# EAGLE design dip40_a1 (EAGLE 5.11)
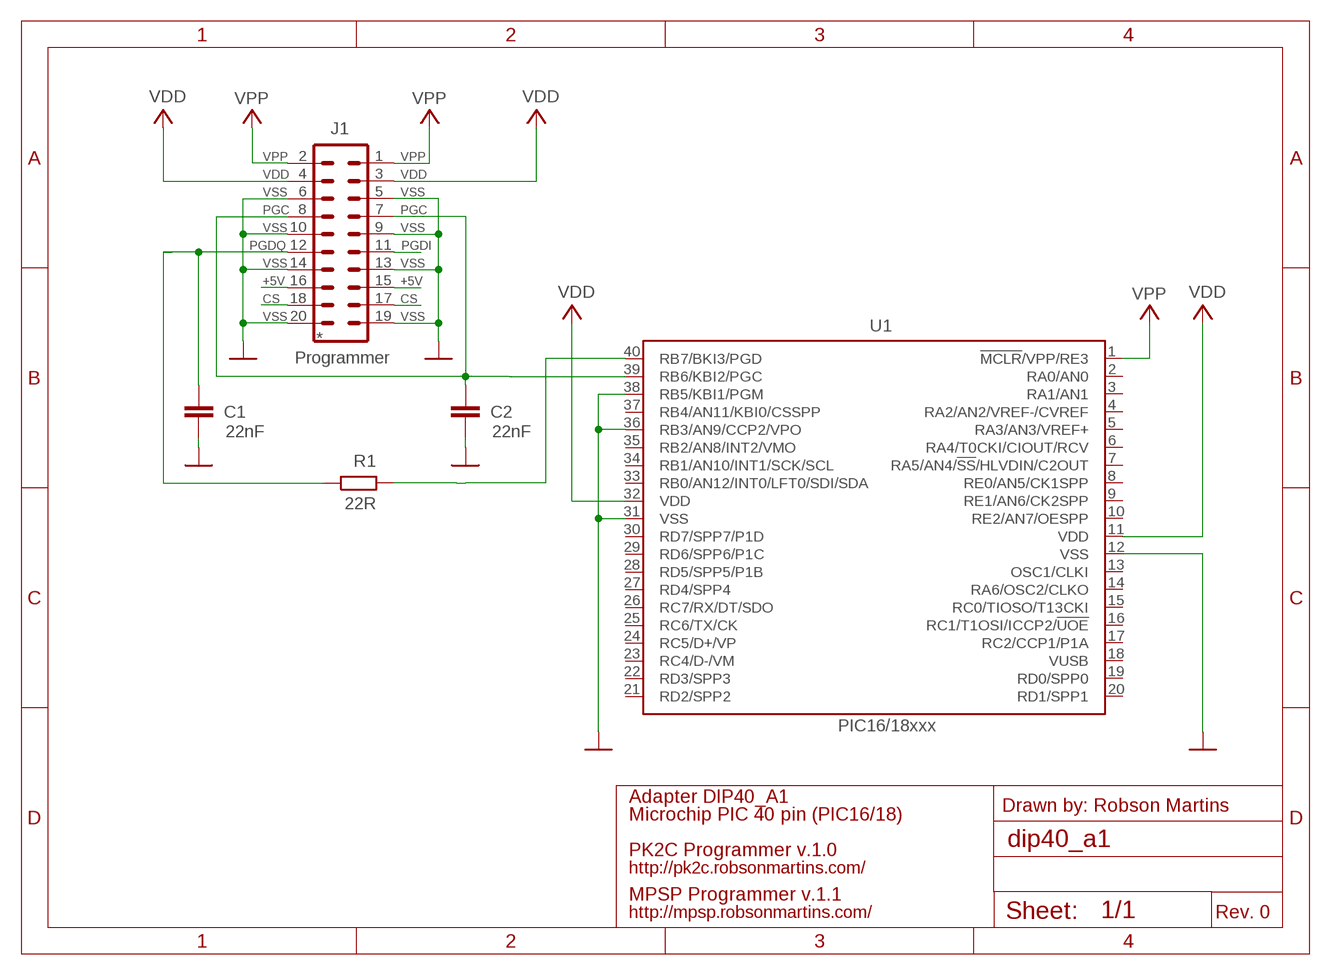
[diagram p0: schematic, sheet 1]

## Parts
C1  22nF  C-EU025-025X050  [C025-025X050]
C2  22nF  C-EU025-025X050  [C025-025X050]
J1  Programmer  MA10-2  [MA10-2]
R1  22R  R-EU_0204/7  [0204/7]
U1  PIC16/18xxx  PIC18F4455_40  [DIL40]

## Nets
+5V: J1.15 J1.16
CS: J1.17 J1.18
GND: C1.2 C2.2 J1.5 J1.6 J1.9 J1.10 J1.13 J1.14 J1.19 J1.20 U1.12(VSS) U1.31(VSS) U1.36(RB3/AN9/CCP2/VPO) U1.38(RB5/KBI1/PGM)
PGC: C2.1 J1.7 J1.8 U1.39(RB6/KBI2/PGC)
PGD: C1.1 J1.12 R1.1
PGD_CHIP: R1.2 U1.40(RB7/BKI3/PGD)
PGDI: J1.11
VDD: J1.3 J1.4 U1.11(VDD) U1.32(VDD)
VPP: J1.1 J1.2 U1.1(!MCLR!/VPP/RE3)
Unconnected: U1.2(RA0/AN0) U1.3(RA1/AN1) U1.4(RA2/AN2/VREF-/CVREF) U1.5(RA3/AN3/VREF+) U1.6(RA4/T0CKI/CIOUT/RCV) U1.7(RA5/AN4/!SS!/HLVDIN/C2OUT) U1.8(RE0/AN5/CK1SPP) U1.9(RE1/AN6/CK2SPP) U1.10(RE2/AN7/OESPP) U1.13(OSC1/CLKI) U1.14(RA6/OSC2/CLKO) U1.15(RC0/TIOSO/T13CKI) U1.16(RC1/T1OSI/ICCP2/!UOE) U1.17(RC2/CCP1/P1A) U1.18(VUSB) U1.19(RD0/SPP0) U1.20(RD1/SPP1) U1.21(RD2/SPP2) U1.22(RD3/SPP3) U1.23(RC4/D-/VM) U1.24(RC5/D+/VP) U1.25(RC6/TX/CK) U1.26(RC7/RX/DT/SDO) U1.27(RD4/SPP4) U1.28(RD5/SPP5/P1B) U1.29(RD6/SPP6/P1C) U1.30(RD7/SPP7/P1D) U1.33(RB0/AN12/INT0/LFT0/SDI/SDA) U1.34(RB1/AN10/INT1/SCK/SCL) U1.35(RB2/AN8/INT2/VMO) U1.37(RB4/AN11/KBI0/CSSPP)

## Notes on the sheet
- VPP | VPP
- VDD | VDD
- VSS | VSS
- PGC | PGC
- VSS | VSS
- PGDQ | PGDI
- VSS | VSS
- +5V | +5V
- CS | CS
- VSS | VSS
- *
- Adapter DIP40_A1
- Drawn by: Robson Martins
- Microchip PIC 40 pin (PIC16/18)
- PK2C Programmer v.1.0
- http://pk2c.robsonmartins.com/
- MPSP Programmer v.1.1
- http://mpsp.robsonmartins.com/ | Rev. 0

## Library data of the parts
C1 C2 = rcl:C-EU: CAPACITOR, European symbol
J1 = con-lstb:MA10-2: PIN HEADER; OC_FARNELL: unknown; OC_NEWARK: unknown
R1 = resistor:R-EU_: RESISTOR, European symbol
U1 = microchip:PIC18F4*_40: USB Microcontrollers with nanoWatt Technology High-Performance, Enhanced Flash, 28/40/44-Pin, Source: http://ww1.microchip.com/downloads/en/devicedoc/39632c.pdf; MF: MICROCHIP; MPN: PIC18F4455-I/P; OC_FARNELL: 9321314; OC_NEWARK: 05K2028

## Board
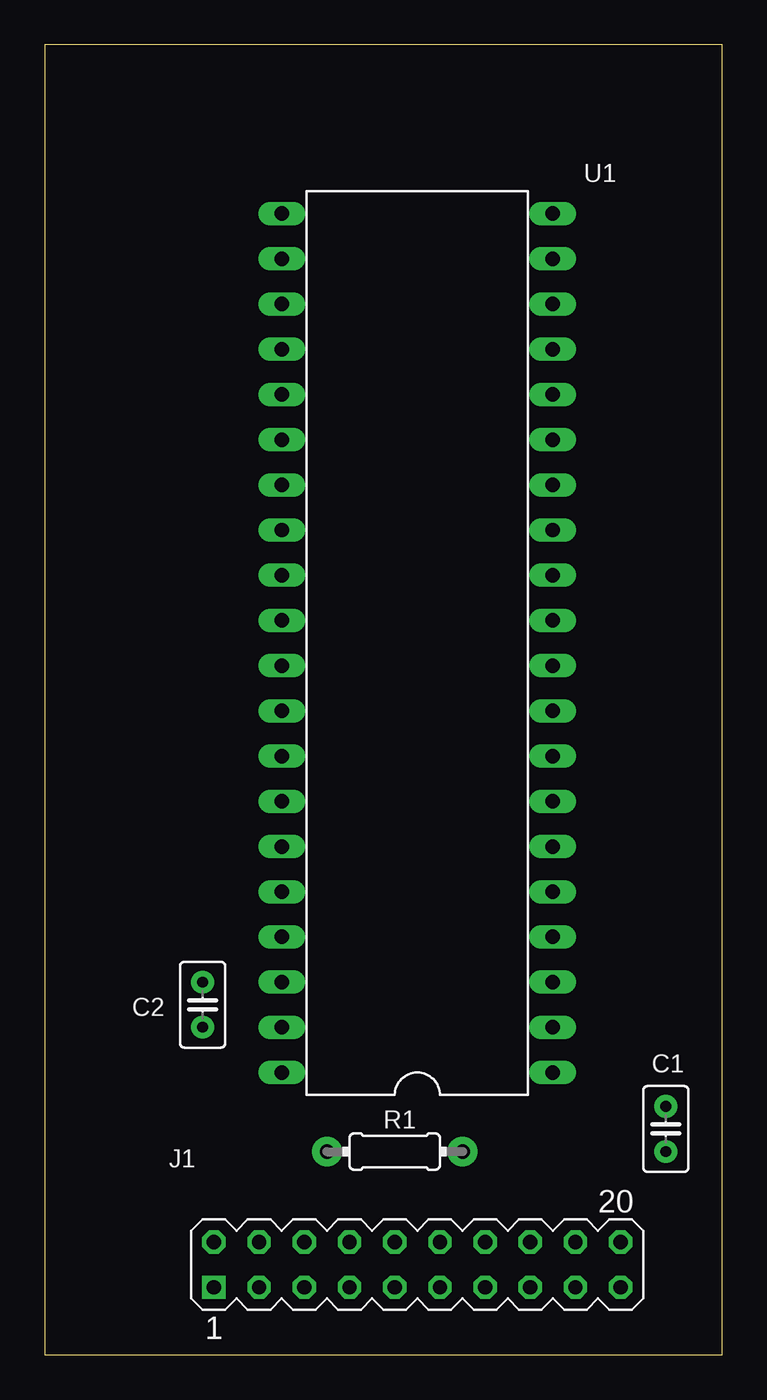
[diagram p1: board, top side]
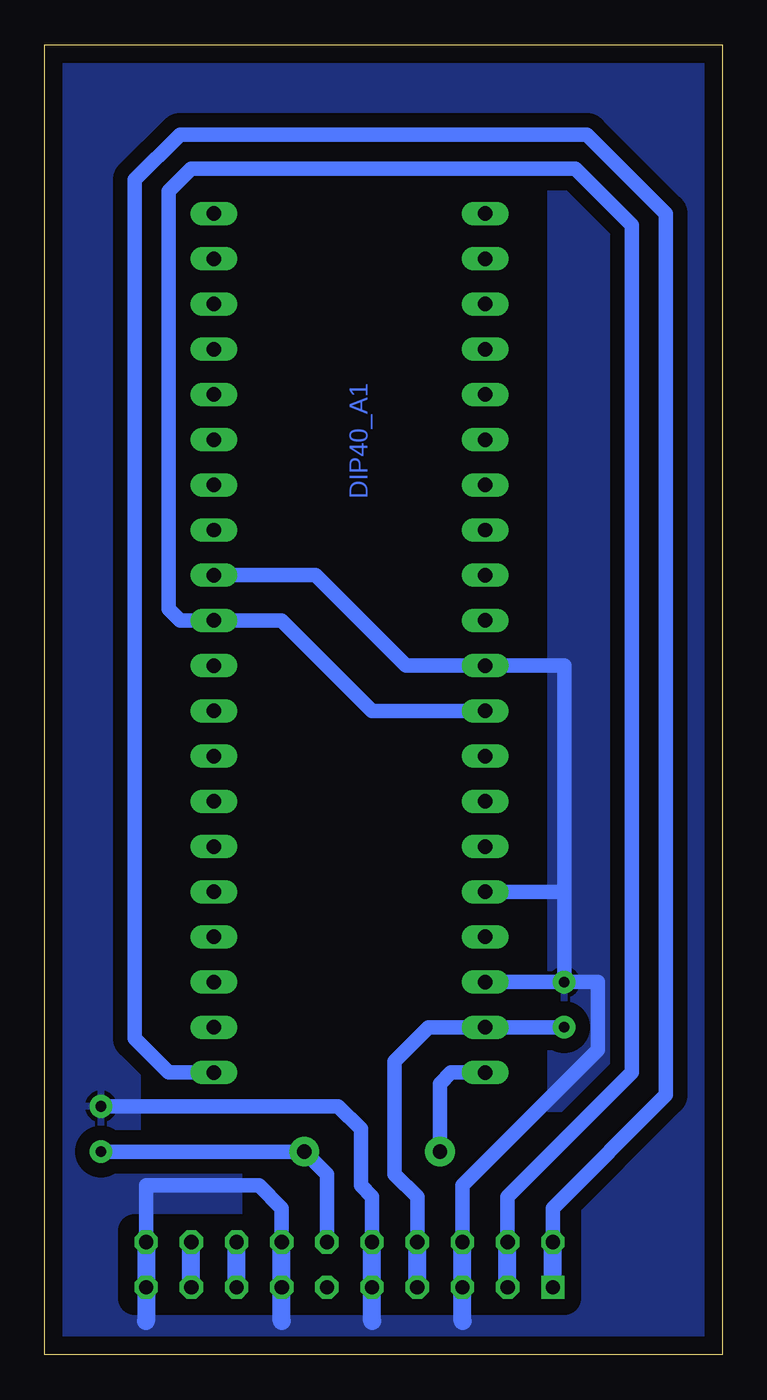
[diagram p2: board, bottom side, seen from below]

Size 38.1 x 73.64 mm. Coordinates in mm from the lower left corner, seen from the top.
Outline: 38.1,0 38.1,73.64 0,73.64 0,0 38.1,0
Copper layers (1*16): Top 0.035mm / dielectric 1.5mm / Bottom 0.035mm
Design rules "default": minimum track width 10mil, minimum drill 24mil, track to track 8mil, track to pad 8mil, pad to pad 8mil, via to via 8mil, smd to smd 8mil, copper to edge 40mil, drill to drill 8mil, minimum pad ring 10mil, minimum via ring 8mil, stop-mask expansion 4mil, vias tented up to drill 0mil, thermal gap 10mil
bRestrict: area 8.9,3.2 to 33,12.7; area 10.8,12.7 to 31.8,65.4

### Footprints (pad centres in the part's own frame; a part is rotated, then mirrored left to right if it is on the bottom)
C025-025X050 = drill 0.6 pad 1.27 round: 1 -1.27,0; 2 1.27,0
MA10-2 = drill 0.8 pad 1.27 square: 1 -11.43,-1.27 | drill 0.8 pad 1.27 octagon: 2 -11.43,1.27; 3 -8.89,-1.27; 4 -8.89,1.27; 5 -6.35,-1.27; 6 -6.35,1.27; 7 -3.81,-1.27; 8 -3.81,1.27; 9 -1.27,-1.27; 10 -1.27,1.27; 11 1.27,-1.27; 12 1.27,1.27; 13 3.81,-1.27; 14 3.81,1.27; 15 6.35,-1.27; 16 6.35,1.27; 17 8.89,-1.27; 18 8.89,1.27; 19 11.43,-1.27; 20 11.43,1.27
0204/7 = drill 0.813 pad 1.676 round: 1 -3.81,0 | drill 0.8 pad 1.676 round: 2 3.81,0
DIL40 = drill 0.813 long: 1 -24.13,-7.62; 2 -21.59,-7.62; 3 -19.05,-7.62; 4 -16.51,-7.62; 5 -13.97,-7.62; 6 -11.43,-7.62; 7 -8.89,-7.62; 8 -6.35,-7.62; 9 -3.81,-7.62; 10 -1.27,-7.62; 11 1.27,-7.62; 12 3.81,-7.62; 13 6.35,-7.62; 14 8.89,-7.62; 15 11.43,-7.62; 16 13.97,-7.62; 17 16.51,-7.62; 18 19.05,-7.62; 19 21.59,-7.62; 20 24.13,-7.62; 21 24.13,7.62; 22 21.59,7.62; 23 19.05,7.62; 24 16.51,7.62; 25 13.97,7.62; 26 11.43,7.62; 27 8.89,7.62; 28 6.35,7.62; 29 3.81,7.62; 30 1.27,7.62; 31 -1.27,7.62; 32 -3.81,7.62; 33 -6.35,7.62; 34 -8.89,7.62; 35 -11.43,7.62; 36 -13.97,7.62; 37 -16.51,7.62; 38 -19.05,7.62; 39 -21.59,7.62; 40 -24.13,7.62

### Placement (x,y rotation side)
C1  34.93,12.7 90 top
C2  8.89,19.68 90 top
J1  20.96,5.08 0 top
R1  19.69,11.43 180 top
U1  20.96,40.01 90 top

### Tracks (layer width: path | path; a pad name or v marks a point on that pad's centre or on a via)
+5V
  Bottom 1.016: J1.15 J1.16
CS
  Bottom 1.016: J1.17 J1.18
GND
  Bottom 0.813: J1.14 24.77,8.26 26.04,9.53 32.39,9.53 J1.20 | J1.6 14.61,8.89 14.61,9.53 6.99,17.14 6.99,17.78 6.99,20.95 C2.2 | U1.12 22.86,43.81 17.78,38.73 U1.31 8.89,38.73 8.89,26.04 | C2.2 U1.38 | C2.2 8.89,26.04 | C1.2 24.77,13.97 21.59,13.97 20.32,12.7 20.32,9.53 19.69,8.89 J1.10 | 8.89,26.04 U1.36
  Bottom 1.016: J1.6 J1.5 14.61,1.91 | J1.10 J1.9 19.69,1.91 | J1.14 J1.13 24.77,1.91 | J1.20 J1.19 32.39,1.91
  pour Bottom (isolate 0.813): 38.1,0 0,0 0,73.66 38.1,73.66
PGC
  Bottom 0.813: J1.8 17.15,7.62 17.15,8.26 17.15,8.89 18.42,10.16 18.42,16.51 16.51,18.41 U1.39 C2.1
  Bottom 1.016: J1.7 J1.8
PGD
  Bottom 0.813: C1.1 R1.1 22.23,10.16 J1.12
PGD_CHIP
  Bottom 0.813: R1.2 15.88,15.24 15.24,15.88 U1.40
VDD
  Bottom 0.813: J1.4 12.07,7.62 12.07,8.89 | J1.3 12.07,8.89 | U1.32 19.69,36.2 24.77,41.27 U1.11 30.48,41.27 31.12,41.91 31.12,43.18 31.12,64.77 31.12,65.41 29.85,66.67 10.8,66.67 8.26,66.67 5.08,63.5 5.08,15.88 12.07,8.89
  Bottom 1.016: J1.3 J1.4
VPP
  Bottom 0.813: J1.1 9.53,7.62 9.53,8.26 3.18,14.61 3.18,64.14 7.62,68.58 10.16,68.58 30.48,68.58 33.02,66.04 33.02,64.77 33.02,41.91 33.02,40.01 33.02,17.78 31.12,15.88 U1.1
  Bottom 1.016: J1.1 J1.2

### Text on the board
Bottom: DIP40_A1
tDocu: Microchip PIC | PIC 16/18 | DIP40_A1 | Adapter | VSS | VPP | VDD | VSS | PGC | VSS | PGD | VSS | +5V | CS